# EAGLE design Board (EAGLE 8.4.0)
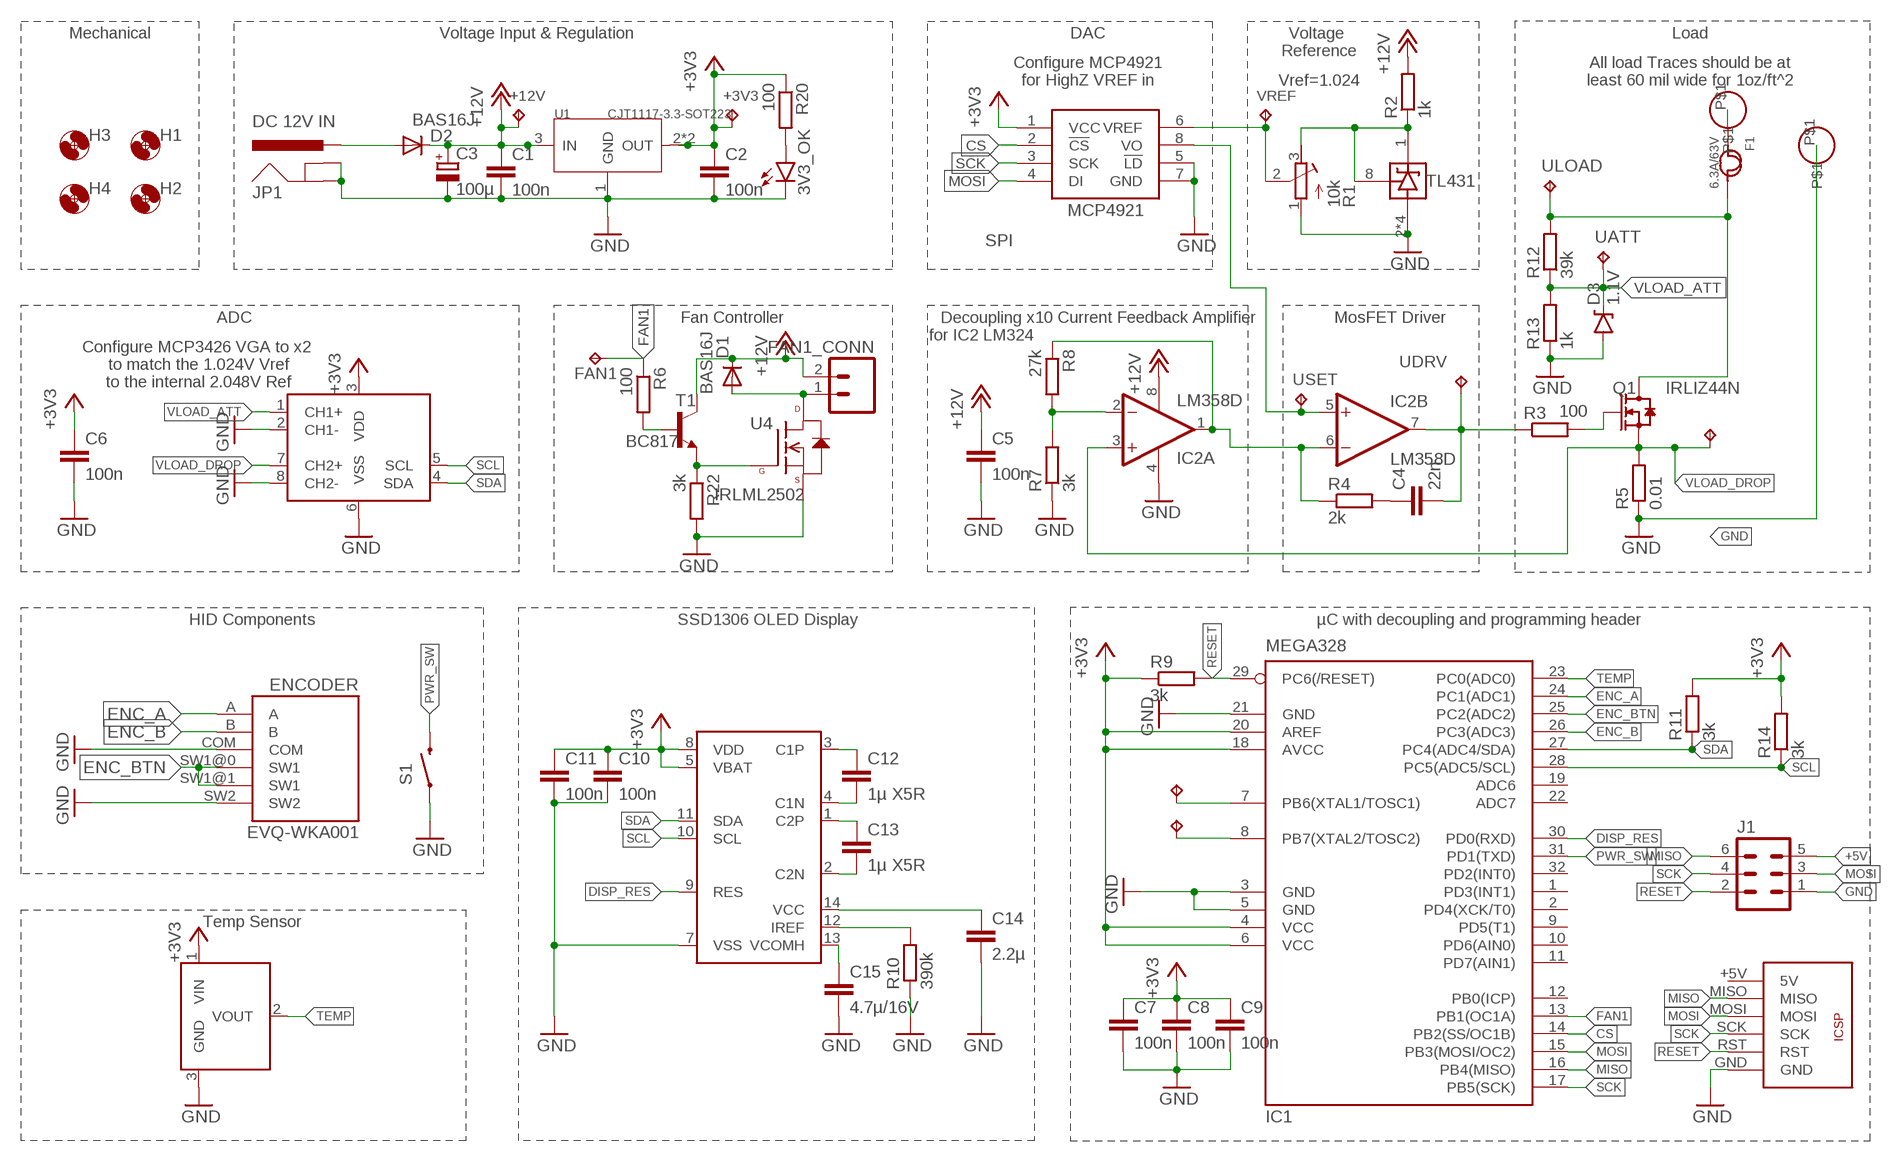
[diagram p0: schematic, sheet 1]

## Parts
3V3_OK  LED0603  [LED-0603]
+3V3  TPB1,27  [B1,27]
+12V  TPB1,27  [B1,27]
C1  100n  C-EUC0603  [C0603]
C2  100n  C-EUC0603  [C0603]
C3  100µ  CPOL-EU153CLV-0405  [153CLV-0405]
C4  22n  C-EUC0603  [C0603]
C5  100n  C-EUC0603  [C0603]
C6  100n  C-EUC0603  [C0603]
C7  100n  C-EUC0603  [C0603]
C8  100n  C-EUC0603  [C0603]
C9  100n  C-EUC0603  [C0603]
C10  100n  C-EUC0603  [C0603]
C11  100n  C-EUC0603  [C0603]
C12  1µ X5R  C-EUC0603  [C0603]
C13  1µ X5R  C-EUC0603  [C0603]
C14  2.2µ  C-EUC0603  [C0603]
C15  4.7µ/16V  C-EUC0603  [C0603]
D1  BAS16J  DIODE-SOD323-W  [SOD323-W]
D2  BAS16J  DIODE-SOD323-W  [SOD323-W]
D3  1.1V  DIODE-ZENER5.6V  [SOD-323]
ENCODER  EVQ-WKA001  [EVQ-WKA001]
F1  6.3A/63V  FUSE'1206'  [F1206]
FAN1  TPB1,27  [B1,27]
FAN1_CONN  M02POLAR  [MOLEX-1X2]
H1  MOUNT-HOLE3.0  [3,0]
H2  MOUNT-HOLE3.0  [3,0]
H3  MOUNT-HOLE3.0  [3,0]
H4  MOUNT-HOLE3.0  [3,0]
IC1  MEGA328  MEGA8-AI  [TQFP32-08]
IC2  LM358D  [SO08]
IC4  MCP3426  [SO08]
IC6  MCP4921  [SO-8]
IC7  TL431CD  [SO-8]
IN+  6MM-BANANA-MOUNTINGHOLE  [6MM-BANANA-MOUNT]
IN-  6MM-BANANA-MOUNTINGHOLE  [6MM-BANANA-MOUNT]
J1  MA03-2  [MA03-2]
JP1  DC 12V IN  POWER_JACKPTH  [POWER_JACK_PTH]
Q1  IRLIZ44N  IRF3710  [TO-220H]
R1  10k  R-TRIMM3296W  [RTRIM3296W]
R2  1k  R-EU_R0603  [R0603]
R3  100  R-EU_R0603  [R0603]
R4  2k  R-EU_R0603  [R0603]
R5  0.01  R-EU_R2512  [R2512]
R6  100  R-EU_R0603  [R0603]
R7  3k  R-EU_R0603  [R0603]
R8  27k  R-EU_R0603  [R0603]
R9  3k  R-EU_R0603  [R0603]
R10  390k  R-EU_R0603  [R0603]
R11  3k  R-EU_R0603  [R0603]
R12  39k  R-EU_R0603  [R0603]
R13  1k  R-EU_R0603  [R0603]
R14  3k  R-EU_R0603  [R0603]
R20  100  R-EU_R0603  [R0603]
R22  3k  R-EU_R0603  [R0603]
S1  SWITCH-MOMENTARY-2SMD-1101NE  [TACTILE-SWITCH-1101NE]
T1  BC817  BC817-NPN-SOT23-BEC  [SOT23-BEC]
U1  CJT1117-3.3-SOT223  PMIC-CJT1117-3.3(SOT223)  [SOT-223]
U3  MCP9701AT-E/TT  [SOT32-3]
U4  IRLML2502  N-CHANNEL-MOSFET-BSS138  [SOT23-3]
U$2  0.86"-OLEDBENT  [0.86"-OLED-BENT]
U$4  ICSP  [ICSP-SMD-NOSILK]
UATT  TPB1,27  [B1,27]
UDROP  TPB1,27  [B1,27]
UDRV  TPB1,27  [B1,27]
ULOAD  TPB1,27  [B1,27]
USET  TPB1,27  [B1,27]
VREF  TPB1,27  [B1,27]
XTAL1  TPB1,27  [B1,27]
XTAL2  TPB1,27  [B1,27]

## Nets
+3V3: +3V3.TP C2.1 C6.1 C7.1 C8.1 C9.1 C10.1 C11.1 IC1.4(VCC) IC1.6(VCC) IC1.18(AVCC) IC1.20(AREF) IC4.3(VDD) IC6.1(VCC) R9.1 R11.2 R14.2 R20.1 U1.2(OUT) U1.TER(OUT) U3.1(VIN) U$2.5(VBAT) U$2.8(VDD)
+5V: J1.5
+12V: +12V.TP C1.1 C3.+ C5.1 D1.C D2.C FAN1_CONN.2 IC2.8(P:V+) R2.2 T1.C U1.3(IN)
CS: IC1.14(PB2(SS/OC1B)) IC6.2(!CS!)
DISP_RES: IC1.30(PD0(RXD)) U$2.9(RES)
ENC_A: ENCODER.A IC1.24(PC1(ADC1))
ENC_B: ENCODER.B IC1.26(PC3(ADC3))
ENC_BTN: ENCODER.SW1@0(SW1) ENCODER.SW1@1(SW1) IC1.25(PC2(ADC2))
FAN1: FAN1.TP IC1.13(PB1(OC1A)) R6.1
GND: 3V3_OK.C C1.2 C2.2 C3.- C5.2 C6.2 C7.2 C8.2 C9.2 C10.2 C11.2 C14.2 C15.2 D3.A ENCODER.COM ENCODER.SW2 IC1.3(GND) IC1.5(GND) IC1.21(GND) IC2.4(P:V-) IC4.2(CH1-) IC4.6(VSS) IC4.8(CH2-) IC6.5(!LD!) IC6.7(GND) IC7.2(ANODE) IC7.3(ANODE) IC7.6(ANODE) IC7.7(ANODE) IN-.P$1 J1.1 JP1.GND JP1.GNDBREAK R1.1(A) R5.1 R7.1 R10.1 R13.1 R22.2 S1.1 U1.1(GND) U3.3(GND) U4.2(S) U$2.7(VSS) U$4.GND
LOAD+: F1.2 Q1.P$2(D) R12.2 ULOAD.TP
MISO: IC1.16(PB4(MISO)) J1.6 U$4.MISO
MOSI: IC1.15(PB3(MOSI/OC2)) IC6.4(DI) J1.3 U$4.MOSI
N$1: IC7.1(CATHODE) IC7.8(REF) R1.3(E) R2.1
N$2: IC6.6(VREF) R1.2(S) VREF.TP
N$3: C4.1 R4.2
N$4: R22.1 T1.E U4.1(G)
N$5: D1.A FAN1_CONN.1 U4.3(D)
N$6: Q1.P$1(G) R3.2
N$7: F1.1 IN+.P$1
N$8: R6.2 T1.B
N$9: IC2.1(A:OUT) IC2.6(B:-IN) R4.1 R8.1
N$10: C4.2 IC2.7(B:OUT) R3.1 UDRV.TP
N$11: IC2.2(A:-IN) R7.2 R8.2
N$12: IC1.8(PB7(XTAL2/TOSC2)) XTAL2.TP
N$13: IC1.7(PB6(XTAL1/TOSC1)) XTAL1.TP
N$16: C12.1 U$2.3(C1P)
N$17: C12.2 U$2.4(C1N)
N$18: C13.1 U$2.1(C2P)
N$19: C13.2 U$2.2(C2N)
N$20: C15.1 U$2.13(VCOMH)
N$21: R10.2 U$2.12(IREF)
N$22: C14.1 U$2.14(VCC)
N$51: 3V3_OK.A R20.2
PWR_SW: IC1.31(PD1(TXD)) S1.2
RESET: IC1.29(PC6(/RESET)) J1.2 R9.2 U$4.RST
SCK: IC1.17(PB5(SCK)) IC6.3(SCK) J1.4 U$4.SCK
SCL: IC1.28(PC5(ADC5/SCL)) IC4.5(SCL) R14.1 U$2.10(SCL)
SDA: IC1.27(PC4(ADC4/SDA)) IC4.4(SDA) R11.1 U$2.11(SDA)
TEMP: IC1.23(PC0(ADC0)) U3.2(VOUT)
VLOAD_ATT: D3.C IC4.1(CH1+) R12.1 R13.2 UATT.TP
VLOAD_DROP: IC2.3(A:+IN) IC4.7(CH2+) Q1.P$3(S) R5.2 UDROP.TP
VLOAD_REF: IC2.5(B:+IN) IC6.8(VO) USET.TP
VSW: D2.A JP1.PWR
Unconnected: IC1.1(PD3(INT1)) IC1.2(PD4(XCK/T0)) IC1.9(PD5(T1)) IC1.10(PD6(AIN0)) IC1.11(PD7(AIN1)) IC1.12(PB0(ICP)) IC1.19(ADC6) IC1.22(ADC7) IC1.32(PD2(INT0)) U$4.+5V(5V)

## Notes on the sheet
- Mechanical | Voltage Input & Regulation | DAC | Load
- Configure MCP4921
  for HighZ VREF in
- Voltage 
  Reference
- All load Traces should be at 
  least 60 mil wide for 1oz/ft^2
- Vref=1.024
- SPI
- ADC | Fan Controller | x10 Current Feedback Amplifier | MosFET Driver
- Configure MCP3426 VGA to x2 
  to match the 1.024V Vref
  to the internal 2.048V Ref
- Decoupling
  for IC2 LM324
- HID Components | SSD1306 OLED Display | µC with decoupling and programming header
- Temp Sensor

## Library data of the parts
3V3_OK = SparkFun-LED:LED: LEDs Standard schematic elements and footprints for 5mm, 3mm, 1206, and 0603 sized LEDs. 5mm - Spark Fun Electronics SKU : COM-00529 (and others)
+3V3 +12V FAN1 UATT UDROP UDRV ULOAD USET VREF XTAL1 XTAL2 = testpad:TP: Test pad
C1 C2 C4-C15 = rcl:C-EU: CAPACITOR, European symbol
C3 = rcl:CPOL-EU: POLARIZED CAPACITOR, European symbol
D1 D2 = diode:DIODE-: DIODE
D3 = SparkFun-DiscreteSemi:DIODE-ZENER: Zener Diode Production Part - 8199 3.4V Zener Voltage; PROD_ID: DIO-12442; VALUE: 5.6V
ENCODER = EVQ-WKA001:EVQ-WKA001
F1 = Seeed-OPL-fuse:FUSE
FAN1_CONN = SparkFun-Connectors:M02: Standard 2-pin 0.1" header. Use with - straight break away headers ( PRT-00116) - right angle break away headers (PRT-00553) - swiss pins (PRT-00743) - machine pins (PRT-00117) - female headers (PRT-00115) Molex polarized connector foot print use with: PRT-08233 with associated crimp pins and housings. 2.54_SCREWTERM for use with PRT-10571. 3.5mm Screw Terminal footprints for PRT-08084 5mm Screw Terminal footprints for use with PRT-08432
H1-H4 = holes:MOUNT-HOLE: MOUNTING HOLE with drill center marker
IC1 = atmel:MEGA8: MICROCONTROLLER 8 Kbytes FLASH, 1 kbytes SRAM, 512 bytes EEPROM, USART, 6-channel 10 bit ADC, 2-channel 8 bit ADC Pin compatible with Atmega48, ATMega88, ATMega168 Source: avr.lbr; MPN: ATMEGA8-16AU; OC_FARNELL: 9171371; OC_NEWARK: 73M8863
IC2 = linear:LM358: OP AMP also LM158; LM258; LM2904 Source: http://cache.national.com/ds/LM/LM158.pdf
IC4 = components:MCP3426
IC6 = OwnStuff:MCP4921
IC7 = OwnStuff:TL431
IN+ IN- = components:6MM-BANANA-MOUNTINGHOLE
J1 = con-lstb:MA03-2: PIN HEADER; OC_FARNELL: unknown; OC_NEWARK: unknown
JP1 = SparkFun-Connectors:POWER_JACK: Power Jack This is the standard 5.5mm barrel jack for power. The PTH is the most common, proven, reliable, footprint. The Slot footprint only works if the mill layer is transmitted to the PCB fab house so be warned. Mating wall wart : TOL-00298 (and others); PROD_ID: CONN-08197
Q1 = components:IRF3710
R1 = rcl:R-TRIMM: Trimm resistor
R2-R14 R20 R22 = rcl:R-EU_: RESISTOR, European symbol
S1 = SparkFun-Electromechanical:SWITCH-MOMENTARY-2: Various NO switches- pushbuttons, reed, etc; PROD_ID: SWCH-00815
T1 = transistor:*-NPN-: NPN Transistror BF959 corrected 2008.03.06
U1 = Seeed-OPL-ic:PMIC-CJT1117-3.3(SOT223): 310030097; MPN: CJT1117-3.3
U3 = components:MCP9701AT-E/TT
U4 = GeekAmmo:N-CHANNEL-MOSFET: N-Channel MOSFET Mode Field Effect Transistor; DATASHEET: http://www.fairchildsemi.com/ds/BS/BSS138.pdf; DIGIKEY: BSS138TR-ND; ELEMENT14: 2323154; URL: http://au.element14.com/fairchild-semiconductor/bss138/mosfet-n-ch-50v-220ma-sot-23/dp/2323154
U$2 = components:0.86"-OLED
U$4 = OwnStuff:ICSP

## Board
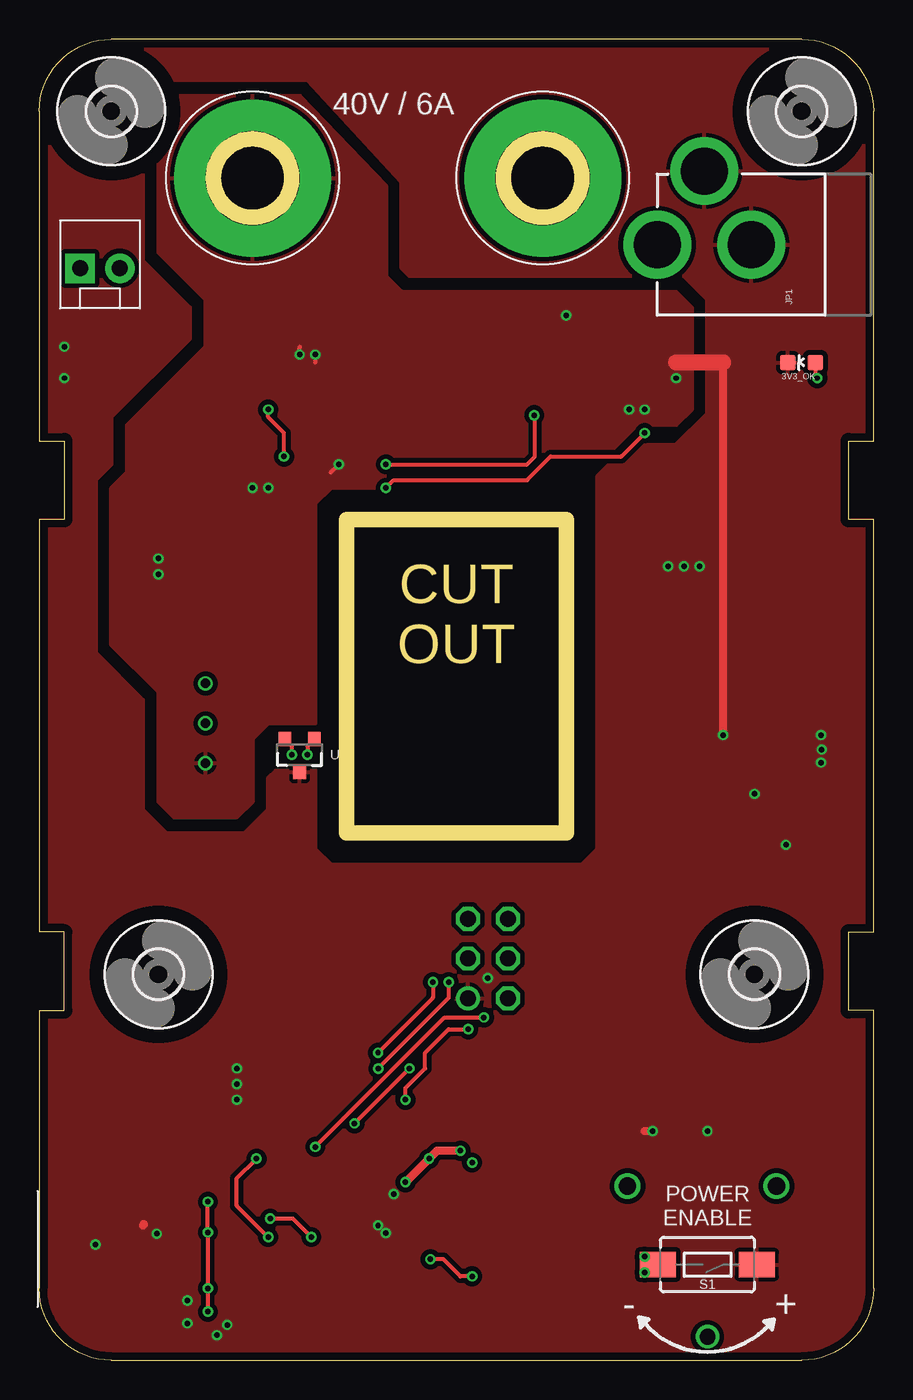
[diagram p1: board, top side]
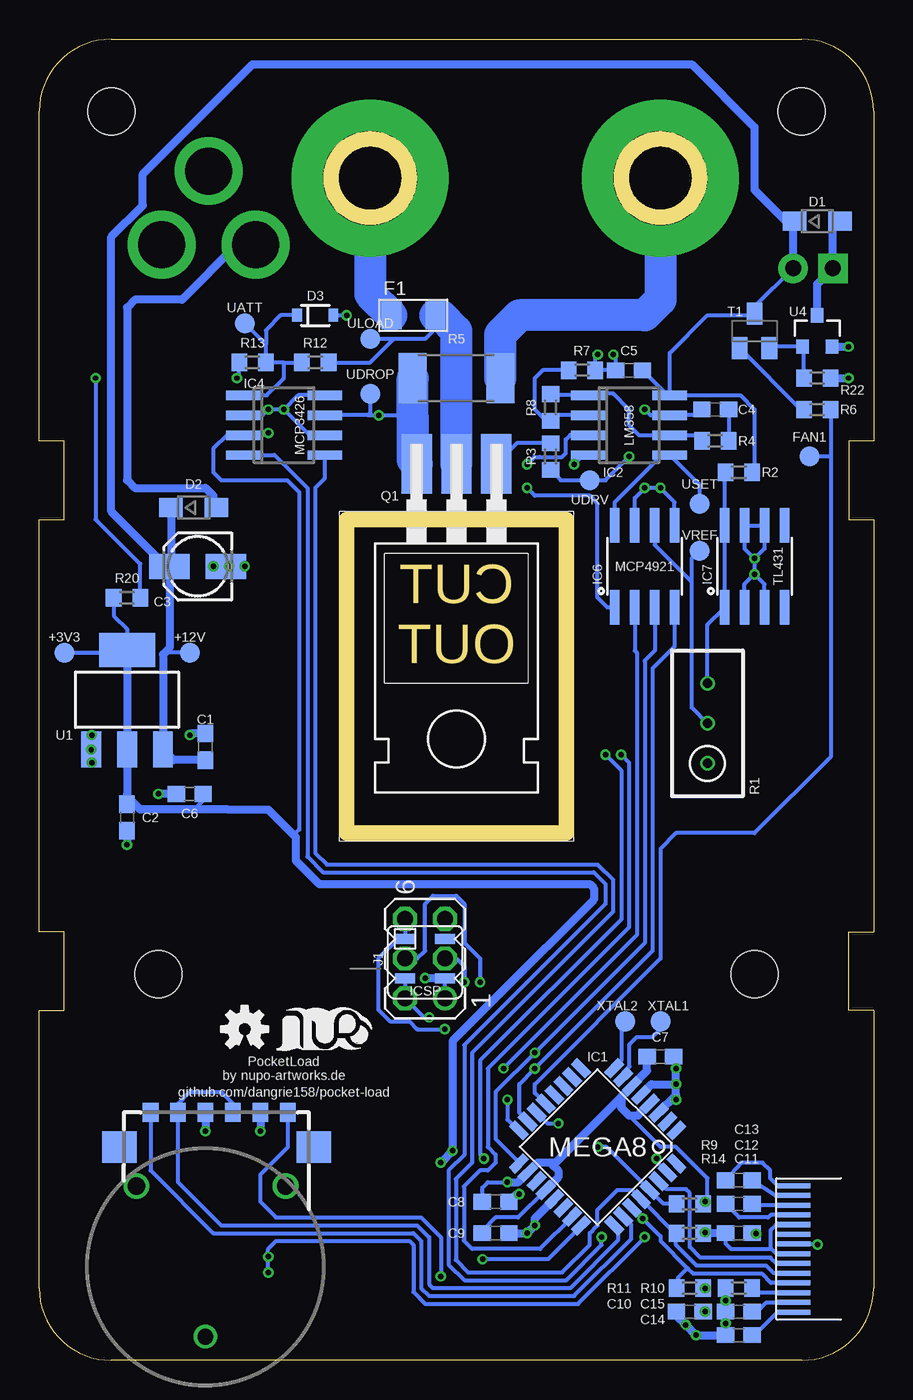
[diagram p2: board, bottom side, seen from below]

Size 53.2 x 84.2 mm. Coordinates in mm from the lower left corner, seen from the top.
Outline: 4.6,0 48.6,0 arc90 53.2,4.6 53.2,22.3 51.6,22.3 51.6,27.3 53.2,27.3 53.2,53.6 51.6,53.6 51.6,58.6 53.2,58.6 53.2,79.6 arc90 48.6,84.2 4.6,84.2 arc90 0,79.6 0,58.6 1.6,58.6 1.6,53.6 0,53.6 0,27.3 1.6,27.3 1.6,22.3 0,22.3 0,4.6 arc90 4.6,0
Copper layers (1*16): Top 0.035mm / dielectric 1.6mm / Bottom 0.035mm
Design rules "Elecrow_2-layer_PCB_eagle_rule *": minimum track width 6mil, minimum drill 12mil, track to track 6mil, track to pad 8mil, pad to pad 6mil, via to via 12mil, smd to smd 0mil, copper to edge 20mil, drill to drill 10mil, minimum pad ring 6mil, minimum via ring 6mil, stop-mask expansion 0mil, vias tented up to drill 100mil, thermal gap 10mil
Milling: 12 lines

### Footprints (pad centres in the part's own frame; a part is rotated, then mirrored left to right if it is on the bottom)
LED-0603 = smd 1 x 1: A 0,-0.877; C 0,0.877
B1,27 = smd 1.27 x 1.27: TP 0,0
C0603 = smd 1.1 x 1: 1 -0.85,0; 2 0.85,0
153CLV-0405 = smd 2.6 x 1.6: + 1.8,0; - -1.8,0
SOD323-W = smd 1.5 x 1.2: A 1.45,0; C -1.45,0
SOD-323 = smd 0.63 x 0.83: A 1.15,0; C -1.15,0
EVQ-WKA001 = smd 1 x 1.2: A -5.25,-4.7; B 3.5,-4.7; COM -3.5,-4.7; SW1@0 1.75,-4.7; SW1@1 -1.75,-4.7; SW2 0,-4.7 | smd 2.2 x 2: NC@0 5.5,-2.5; NC@1 -6.9,-2.5 | drill 1.1: P$9 4.4,0; P$10 -5.1,0 | drill 1: P$11 0,9.6
F1206 = smd 1.27 x 1.778: 1 -1.397,0; 2 1.397,0
MOLEX-1X2 = drill 1.016 pad 1.88 square: 1 0,0 | drill 1.016 pad 1.88: 2 2.54,0
3,0 = hole 3: 0,0
TQFP32-08 = smd 1.27 x 0.559: 1 -4.293,2.8; 2 -4.293,2; 3 -4.293,1.2; 4 -4.293,0.4; 5 -4.293,-0.4; 6 -4.293,-1.2; 7 -4.293,-2; 8 -4.293,-2.8; 17 4.293,-2.8; 18 4.293,-2; 19 4.293,-1.2; 20 4.293,-0.4; 21 4.293,0.4; 22 4.293,1.2; 23 4.293,2; 24 4.293,2.8 | smd 0.559 x 1.27: 9 -2.8,-4.293; 10 -2,-4.293; 11 -1.2,-4.293; 12 -0.4,-4.293; 13 0.4,-4.293; 14 1.2,-4.293; 15 2,-4.293; 16 2.8,-4.293; 25 2.8,4.293; 26 2,4.293; 27 1.2,4.293; 28 0.4,4.293; 29 -0.4,4.293; 30 -1.2,4.293; 31 -2,4.293; 32 -2.8,4.293
SO08 = smd 0.6 x 2.2: 1 -1.905,-2.6; 2 -0.635,-2.6; 3 0.635,-2.6; 4 1.905,-2.6; 5 1.905,2.6; 6 0.635,2.6; 7 -0.635,2.6; 8 -1.905,2.6
SO-8 = smd 0.61 x 2.21: 1 -1.905,-2.616; 2 -0.635,-2.616; 3 0.635,-2.616; 4 1.905,-2.616; 5 1.905,2.616; 6 0.635,2.616; 7 -0.635,2.616; 8 -1.905,2.616
6MM-BANANA-MOUNT = drill 6 pad 10: P$1 0,0
MA03-2 = drill 1.016: 1 -2.54,-1.27 | drill 1.016 octagon: 2 -2.54,1.27; 3 0,-1.27; 4 0,1.27; 5 2.54,-1.27; 6 2.54,1.27
POWER_JACK_PTH = drill 2.997 pad 4.318: GND 0,7.7; GNDBREAK 4.7,10.7; PWR 0,13.7
TO-220H = smd 1.93 x 3.81: P$1 -2.54,-2.54; P$2 0,-2.54; P$3 2.54,-2.54
RTRIM3296W = drill 0.61: 1 0,-2.54; 2 0,0; 3 0,2.54
R0603 = smd 1 x 1.1: 1 -0.85,0; 2 0.85,0
R2512 = smd 1.8 x 3.2: 1 -2.8,0; 2 2.8,0
TACTILE-SWITCH-1101NE = smd 2.3 x 1.6: 1 -3.15,0; 2 3.15,0
SOT23-BEC = smd 1 x 1.4: B -0.95,-1.1; C 0,1.1; E 0.95,-1.1
SOT-223 = smd 1.27 x 2.286: 1 -2.286,-3.175; 2 0,-3.175; 3 2.286,-3.175 | smd 3.556 x 2.159: TER 0,3.175
SOT32-3 = smd 0.8 x 0.9: 1 -0.95,-1; 2 0.95,-1; 3 0,1.1
SOT23-3 = smd 0.8 x 0.9: 1 -0.95,-1; 2 0.95,-1; 3 0,1
0.86"-OLED-BENT = smd 2.1 x 0.32 bottom: 1 0,4.03; 2 0,3.41; 3 0,2.79; 4 0,2.17; 5 0,1.55; 6 0,0.93; 7 0,0.31; 8 0,-0.31; 9 0,-0.93; 10 0,-1.55; 11 0,-2.17; 12 0,-2.79; 13 0,-3.41; 14 0,-4.03
ICSP-SMD-NOSILK = smd 1.27 x 0.635: +5V 1.27,1.27; GND 1.27,-1.27; MISO -1.27,1.27; MOSI 1.27,0; RST -1.27,-1.27; SCK -1.27,0

### Placement (x,y rotation side)
3V3_OK  48.6,63.6 90 top
+3V3  51.6,45.1 0 bottom
+12V  43.6,45.1 0 bottom
C1  42.6,39.1 90 bottom
C2  47.6,34.6 270 bottom
C3  43.1,50.6 180 bottom
C4  10.1,60.6 180 bottom
C5  15.6,63.1 180 bottom
C6  43.6,36.1 180 bottom
C7  13.6,19.35 0 bottom
C8  24.1,10.1 0 bottom
C9  24.1,8.1 0 bottom
C10  11.72,3.1 180 bottom
C11  8.6,8.1 0 bottom
C12  8.6,9.97 180 bottom
C13  8.6,11.47 0 bottom
C14  8.6,1.6 180 bottom
C15  8.6,3.1 180 bottom
D1  3.6,72.6 0 bottom
D2  43.35,54.35 0 bottom
D3  35.6,66.6 0 bottom
ENCODER  42.6,11.1 180 bottom
F1  29.35,66.6 0 bottom
FAN1  4.1,57.6 0 bottom
FAN1_CONN  2.6,69.6 0 top
H1  4.6,79.6 0 top
H2  48.6,79.6 0 top
H3  45.6,24.6 0 top
H4  7.6,24.6 0 top
IC1  17.6,13.6 225 bottom
IC2  15.6,59.6 270 bottom
IC4  37.6,59.6 270 bottom
IC6  14.6,50.6 0 bottom
IC7  7.6,50.6 0 bottom
IN+  32.1,75.35 0 top
IN-  13.6,75.35 0 top
J1  28.6,25.6 90 bottom
JP1  53.1,71.1 90 top
Q1  26.6,54.6 180 bottom
R1  10.6,40.6 0 bottom
R2  8.6,56.6 0 bottom
R3  20.6,57.6 90 bottom
R4  10.1,58.6 0 bottom
R5  26.6,62.6 180 bottom
R6  3.6,60.6 180 bottom
R7  18.6,63.1 180 bottom
R8  20.6,60.73 270 bottom
R9  11.72,9.97 180 bottom
R10  8.6,4.6 0 bottom
R11  11.72,4.6 0 bottom
R12  35.6,63.6 0 bottom
R13  39.6,63.6 0 bottom
R14  11.72,8.1 0 bottom
R20  47.6,48.6 0 bottom
R22  3.6,62.6 0 bottom
S1  42.6,6.1 180 top
T1  7.6,65.6 0 bottom
U1  47.6,42.1 0 bottom
U3  16.6,38.6 180 top
U4  3.6,65.6 0 bottom
U$1  [LOGO-SILKSCREEEN-S]  35.1,20.6 0 bottom
U$2  5.1,7.1 0 top
U$3  [OSHW-LOGO-S]  40.1,21.1 0 bottom
U$4  28.6,25.6 0 bottom
UATT  40.1,66.1 0 bottom
UDROP  32.1,61.6 0 bottom
UDRV  18.1,56.1 0 bottom
ULOAD  32.1,65.1 0 bottom
USET  11.1,54.6 0 bottom
VREF  11.1,51.6 0 bottom
XTAL1  13.6,21.6 0 bottom
XTAL2  15.85,21.6 0 bottom

### Tracks (layer width: path | path; a pad name or v marks a point on that pad's centre or on a via)
+3V3  (via drill 0.35)
  Top 0.254: v22.1,55.6 22.6,56.1 31.1,56.1 32.6,57.6 37.1,57.6 v38.6,59.1 | v10.75,10.1 v10.75,8.15 v10.75,4.59 v10.75,3.1 | 17.6,39.6 17.55,39.65 U3.1 17.1,39.15 v17.1,38.6
  Top 0.508: v26.85,13.35 25.35,13.35 v24.85,12.85 v23.35,11.35
  Bottom 0.254: 9.2,8.1 C11.1 9.45,7.45 9.1,7.1 6.59,7.1 6.56,7.13 6.55,7.13 | U$2.5 6.21,8.65 6.55,8.31 6.55,7.13 | U$2.8 6.21,6.79 6.55,7.13 | 47.6,36.25 47.6,36.09 C2.1 | R20.1 48.45,47.45 47.6,46.6 U1.TER 47.77,45.1 +3V3.TP | IC6.1 16.98,47.98 17.6,48.6 17.6,54.6 18.1,55.1 21.6,55.1 v22.1,55.6 | v38.6,59.1 38.73,58.97 IC4.3 41.23,58.97 42.1,58.1 42.1,56.6 41.6,56.1 37.39,56.1 36.62,55.33 36.62,33.82 36.97,33.47 | IC1.20 22.67,9.1 24.1,9.1 24.95,8.25 C9.1 | 15.6,15.6 13.6,13.6 12.6,13.6 10.6,11.6 10.6,10.25 v10.75,10.1 R9.1 | R11.2 v10.75,4.59 | R14.2 v10.75,8.15 | 23.6,23.6 23.85,23.35 | C8.1 24.95,11 24.6,11.35 v23.35,11.35 | C6.1 42.75,35.68 43.33,35.1 | 41.1,35.15 41.15,35.1 | C10.1 v10.75,3.1 | v17.1,38.6 16.1,37.6 16.1,28.1 25.1,19.1 25.1,13.1 v24.85,12.85
  Bottom 0.508: C11.1 R14.2 | U1.TER U1.2 47.6,36.09 47.6,35.95 46.75,35.1 43.33,35.1 41.15,35.1 38.6,35.1 36.97,33.47 36.85,33.35 36.85,31.85 35.35,30.35 18.1,30.35 17.85,30.1 17.85,29.35 23.85,23.35 26.85,20.35 v26.85,13.35 v27.6,12.6 | 23.45,11.35 v23.35,11.35 22.68,11.35 IC1.18 21.43,12.6 20.6,12.6 | IC1.4 15.03,15.6 15.6,15.6 16.1,16.1 16.1,16.8 | 16.1,16.8 IC1.6 14.45,18.45 C7.1 | IC1.20 20.1,11.67 20.1,12.1 20.6,12.6 | 16.1,16.8 20.3,12.6 20.6,12.6
+12V
  Bottom 0.254: 7.6,67.14 FAN1_CONN.2 | IC2.8 13.15,61.51 C5.1 | IC2.8 13,64.2 10.6,66.6 7.7,66.6 T1.C | IC2.8 8.51,61.51 7.6,60.6 7.6,56.75 R2.2 | +12V.TP 45.21,45.1 45.31,45
  Bottom 0.508: T1.C 7.6,67.14 | FAN1_CONN.2 5.14,72.51 D1.C 5.6,72.6 7.6,74.6 7.6,78.6 11.6,82.6 39.6,82.6 46.6,75.6 46.6,73.6 48.6,71.6 48.6,54.1 45.1,50.6 C3.+ | C1.1 44.64,38.25 U1.3 45.31,45 44.9,45.41 C3.+ | D2.C 44.8,50.7 C3.+
CS  (via drill 0.35)
  Top 0.254: v20.1,15.1 v23.6,18.6
  Bottom 0.254: IC6.2 15.23,45.23 15.1,45.1 15.1,27.1 v23.6,18.6 | IC1.14 20.8,15.1 v20.1,15.1
DISP_RES
  Bottom 0.254: U$2.9 6.21,6.17 6.58,6.54 11.04,6.54 11.72,7.22 11.72,10.66 11.97,10.9 13.21,10.9 IC1.30
ENC_A  (via drill 0.35)
  Top 0.254: v27.6,5.35 26.85,5.35 25.76,6.44 v24.94,6.44
  Bottom 0.254: ENCODER.A 37.35,13.6 39.1,11.85 39.1,10.1 38.1,9.1 28.85,9.1 27.6,7.85 v27.6,5.35 | v24.94,6.44 20.76,6.44 18.66,8.54 IC1.24
ENC_B
  Bottom 0.254: ENCODER.B 46.1,12.1 42.1,8.1 29.35,8.1 28.85,7.6 28.85,4.6 28.35,4.1 19.1,4.1 15.47,7.72 15.47,8.65 IC1.26
ENC_BTN
  Bottom 0.254: ENCODER.SW1@1 40.85,16.35 41.6,17.1 43.6,17.1 44.35,16.35 ENCODER.SW1@0 44.35,11.35 41.6,8.6 29.1,8.6 28.35,7.85 28.35,4.85 28.1,4.6 19.35,4.6 16.3,7.65 16.3,8.34 IC1.25
FAN1
  Bottom 0.254: R6.1 2.75,57.6 | 2.75,57.6 2.75,38.45 7.6,33.6 12.6,33.6 13.6,32.6 13.6,25.6 21.6,17.6 21.6,17.03 IC1.13 | 2.75,57.6 FAN1.TP
GND  (via drill 0.35)
  Top 0.254: v19.1,57.1 18.6,56.6 | v16.6,64.1 16.6,64.6 | v17.6,64.1 17.6,63.6 | v3.58,7.37 3.6,7.6
  Top 0.508: v43.6,39.85 43.6,63.6 | v39.1,14.6 38.6,14.6 | 6.69,8.69 6.6,8.6
  Top 1.016: 43.6,63.6 40.6,63.6
  Bottom 0.254: R13.1 40.45,62.75 v40.6,62.6 | IC4.2 38.97,60.23 v38.6,60.6 v37.6,60.6 | IC4.8 36.7,61.51 v37.6,60.6 | IC4.6 35.97,58.97 v37.6,60.6 | IC2.4 18.51,57.7 v19.1,57.1 | v16.6,64.1 16.45,63.95 C5.2 R7.1 17.75,63.95 v17.6,64.1 | IC7.3 6.96,49.47 v7.6,50.1 | IC7.2 8.23,49.47 v7.6,50.1 | v7.6,51.1 v7.6,50.1 | v7.6,51.1 8.23,51.73 IC7.7 IC7.6 6.96,51.73 v7.6,51.1 | IC6.5 12.7,54.7 v13.6,55.6 v14.6,55.6 15.23,54.97 IC6.7 | U$2.7 3.87,7.41 v3.58,7.37 | D3.A v33.6,66.6 | J1.1 U$4.GND
  Bottom 0.508: R22.2 v1.6,62.6 | U4.2 v1.6,64.6 | U1.1 49.89,38.14 v49.85,38.1 | C2.2 v47.6,32.85 | C6.2 v45.6,36.1 | C1.2 43.5,39.95 v43.6,39.85 | ENCODER.SW2 v42.6,14.6 | ENCODER.COM v39.1,14.6 | v12.6,17.6 v12.61,17.61 12.61,16.9 | 12.61,16.9 IC1.3 | v12.6,16.6 v12.61,16.61 12.61,16.9 | IC1.21 21.6,9.03 v21.6,8.6 v22.1,8.1 C9.2 | C8.2 22.75,10.6 v22.6,10.6 | R10.1 v9.45,3.81 C15.2 v9.45,2.36 C14.2 v11.32,1.6 v11.98,2.26 12.57,2.85 C10.2 | C11.2 7.46,8.1 v7.49,8.06 | v12.6,17.6 v12.6,18.6 12.6,19.2 C7.2 | IC1.5 14.17,17.6 v12.6,17.6 | C3.- v41.1,50.6 | U$4.GND 27.35,24.35 v28.6,24.35
  Bottom 2.032: R5.1 23.8,65.4 22.6,66.6 14.6,66.6 13.6,67.6 IN-.P$1
  other vias: 49.89,38.93 49.85,39.85 40.1,50.6 42.1,50.6
  pour Top (isolate 0.305, rank 2): 14.6,40.6 13.6,39.6 13.6,35.6 12.6,34.6 8.6,34.6 7.6,35.6 7.6,42.6 4.6,45.6 4.6,55.6 5.6,56.6 5.6,59.6 10.6,64.6 10.6,67.6 7.6,70.6 7.6,80.6 16.6,80.6 22.1,74.85 22.1,69.1 23.1,68.1 40.6,68.1 41.6,67.1 41.6,60.6 40.6,59.6 38.1,59.6 36.1,57.6 32.6,57.6 30.6,55.6 18.6,55.6 17.6,54.6 17.6,40.6
  pour Top (isolate 0.305): 48.6,0.6 4.6,0.6 arc-90 0.6,4.6 0.6,80.6 6.6,80.6 6.6,70.1 9.6,67.1 9.6,65.1 4.6,60.1 4.6,57.1 3.6,56.1 3.6,45.1 6.6,42.1 6.6,35.1 8.1,33.6 13.1,33.6 14.6,35.1 14.6,37.1 15.1,37.6 17.6,37.6 17.6,32.6 18.6,31.6 34.6,31.6 35.6,32.6 35.6,56.35 37.6,58.35 40.6,58.35 42.6,60.35 42.6,67.6 41.1,69.1 23.6,69.1 23.1,69.6 23.1,75.1 17.1,81.6 4.6,81.6 4.6,83.6 48.6,83.6 arc-90 52.6,79.6 52.6,4.6 arc-90
LOAD+
  Bottom 0.254: R12.2 32.1,63.6 30.6,65.1 | 30.6,65.1 28.6,65.1 28.1,65.6 28.1,66.45 F1.2 | 30.6,65.1 ULOAD.TP
  Bottom 2.032: Q1.P$2 26.6,65.6 27.6,66.6 F1.2
MISO  (via drill 0.35)
  Top 0.254: v23.35,16.6 23.35,17.35 24.6,18.6 24.6,19.6 26.1,21.1 v27.35,21.1
  Bottom 0.254: IC1.16 22.66,14.65 23.35,15.35 v23.35,16.6 | J1.6 U$4.MISO 30.33,26.87 31.6,25.6 31.6,22.35 30.85,21.6 29.6,21.6 29.1,21.1 v27.35,21.1
MOSI  (via drill 0.35)
  Top 0.254: v26.1,24.1 26.1,23.1 v21.6,18.6 v21.61,18.59
  Bottom 0.254: IC6.4 12.7,45.51 14.1,44.1 14.1,26.1 v21.61,18.59 22.6,17.6 22.6,15.77 IC1.15 | J1.3 26.6,25.6 26.1,25.1 v26.1,24.1
N$1
  Bottom 0.254: R1.3 10.6,46.89 IC7.1 IC7.8 9.5,56.55 R2.1
N$2
  Bottom 0.254: IC6.6 13.96,51.97 11.6,49.6 | 11.6,49.6 11.6,41.6 R1.2 | 11.6,49.6 11.6,51.1 VREF.TP
N$3
  Bottom 0.254: C4.1 R4.2
N$4
  Bottom 0.254: T1.E 6.55,64.6 U4.1 4.45,64.5 R22.1
N$5
  Bottom 0.508: D1.A 2.6,72.15 FAN1_CONN.1 3.6,68.6 U4.3
N$6
  Bottom 0.254: R3.2 22.75,58.45 Q1.P$1
N$7
  Bottom 2.032: IN+.P$1 32.1,67.95 F1.1
N$8
  Bottom 0.254: R6.2 4.65,60.6 T1.B
N$9
  Bottom 0.254: 18.33,61.51 IC2.1 | 18.33,61.51 20.55,61.51 R8.1 | 18.33,61.51 18.24,61.6 16.6,61.6 15.6,60.6 15.6,59.6 14.96,58.97 IC2.6 11.31,58.97 R4.1
N$10  (via drill 0.35)
  Top 0.254: v15.6,57.6 15.6,59.1 14.6,60.1 v14.6,60.6
  Bottom 0.254: C4.2 11.31,60.23 IC2.7 14.23,60.23 v14.6,60.6 | R3.1 19.95,56.1 UDRV.TP 17.1,56.1 v15.6,57.6
N$11
  Bottom 0.254: IC2.2 20.12,60.23 R8.2 20.88,59.88 21.6,60.6 21.6,62.6 21.1,63.1 R7.2
N$12
  Bottom 0.254: IC1.8 16.55,18.66 16.1,19.1 16.1,21.1 15.85,21.35 XTAL2.TP
N$13
  Bottom 0.254: IC1.7 15.98,18.32 15.57,18.73 15.57,20.13 15.1,20.6 14.1,20.6 13.6,21.1 XTAL1.TP
N$16
  Bottom 0.254: U$2.3 7.64,9.89 7.72,9.97 C12.1
N$17
  Bottom 0.254: U$2.4 6.55,9.27 6.72,9.1 8.57,9.1 C12.2
N$18
  Bottom 0.254: U$2.1 6.13,11.13 6.6,11.6 6.6,12.1 7.1,12.6 8.45,12.6 C13.1
N$19
  Bottom 0.254: U$2.2 6.28,10.51 C13.2
N$20
  Bottom 0.254: U$2.13 6.84,3.69 7.43,3.1 C15.1
N$21
  Bottom 0.254: 6.05,4.31 U$2.12 7.46,4.31 R10.2
N$22
  Bottom 0.254: C14.1 7.6,1.6 6.1,3.1 5.13,3.1 U$2.14
N$51  (via drill 0.35)
  Top 0.254: 3V3_OK.A 49.48,62.72 v49.6,62.6
  Bottom 0.254: R20.2 46.75,50.75 49.55,53.55 | 49.55,53.55 49.6,53.6 | v49.6,62.6 49.6,53.6 | 49.6,53.6 49.55,53.55
PWR_SW  (via drill 0.35)
  Top 0.254: S1.2 38.95,6.6 v38.6,6.6 | v14.6,7.85 12.6,9.85 12.6,11.6 v13.85,12.85
  Bottom 0.254: v38.6,5.6 v38.6,6.6 38.6,7.1 38.1,7.6 29.6,7.6 29.35,7.35 29.35,4.35 28.6,3.6 18.85,3.6 v14.6,7.85 | IC1.31 13.85,12.68 v13.85,12.85
RESET  (via drill 0.35)
  Top 0.254: v17.6,13.6 25.85,21.85 v28.35,21.85
  Bottom 0.254: R9.2 13.41,9.97 IC1.29 17.03,13.6 v17.6,13.6 | U$4.RST J1.2 28.66,21.85 v28.35,21.85
SCK  (via drill 0.35)
  Top 0.254: v25.1,24.1 25.1,23.1 v21.6,19.6
  Bottom 0.254: IC6.3 13.96,45.23 14.6,44.6 14.6,26.6 v21.6,19.6 24.1,17.1 24.1,14.1 22.62,12.62 IC1.17 | 29.6,25.6 J1.4 29.1,25.6 28.6,26.1 28.6,29.1 28.1,29.6 26.6,29.6 26.1,29.1 26.1,26.6 25.1,25.6 v25.1,24.1
SCL
  Bottom 0.254: U$2.10 6.38,5.55 6.86,6.03 11.29,6.03 12.6,7.35 12.6,7.95 R14.1 12.67,8.1 IC1.28 | 14.63,10.28 IC1.28 | IC4.5 35,56.2 35.6,55.6 35.6,32.35 34.85,31.6 17.6,31.6 16.6,30.6 16.6,28.6 25.6,19.6 25.6,12.6 26.64,11.56 26.64,6.39 25.85,5.6 19.87,5.6 18.1,7.37 18.1,8.1 17.6,8.6 17.6,9.6 16.35,10.85 15.42,10.85 IC1.28
SDA  (via drill 0.35)
  Top 0.254: v14.72,9.03 16.17,9.03 v17.35,7.85
  Bottom 0.254: U$2.11 6.55,4.93 7.14,5.53 11.53,5.53 11.87,5.87 | IC4.4 38.2,57.7 36.1,55.6 36.1,32.1 35.1,31.1 17.85,31.1 17.1,30.35 17.1,29.1 26.1,20.1 26.1,13.1 27.1,12.1 27.1,6.1 26.1,5.1 19.6,5.1 17.35,7.35 17.38,7.85 v17.35,7.85 | IC1.27 v14.72,9.03 13.6,7.9 13.6,7.6 11.87,5.87 | R11.1 12.45,5.29 11.87,5.87
TEMP  (via drill 0.35)
  Top 0.254: U3.2 16.1,39.15 v16.1,38.6
  Bottom 0.254: IC1.23 21.27,7.1 25.6,7.1 26.13,7.63 26.13,11.07 25.1,12.1 24.6,12.1 24.1,12.6 24.1,13.1 24.6,13.6 24.6,18.6 15.6,27.6 15.6,38.1 v16.1,38.6
VLOAD_ATT
  Bottom 0.254: 37.65,63.6 R13.2 | 37.65,63.6 R12.1 | IC4.1 38.7,61.51 37.6,62.6 37.6,63.55 37.65,63.6 | R13.2 38.75,63.75 | R13.2 38.75,64.75 | 38.75,64.75 UATT.TP | 38.75,64.75 38.75,65.65 37.8,66.6 D3.C
VLOAD_DROP  (via drill 0.35)
  Top 0.254: v22.1,57.1 31.1,57.1 31.6,57.6 31.6,60.19 v31.55,60.23
  Bottom 0.254: 32.23,60.23 IC4.7 | 32.23,60.23 v31.55,60.23 29.56,60.23 29.4,60.07 | UDROP.TP 32.1,60.37 32.23,60.23 | v22.1,57.1 21.63,57.57 21.3,57.57 21.29,57.58 19.87,57.58 19.63,57.82 19.63,58.7 19.35,58.98 IC2.3
  Bottom 2.032: R5.2 29.4,60.07 29.4,57.4 Q1.P$3
VLOAD_REF
  Bottom 0.254: IC6.8 16.5,54.7 13.5,57.7 IC2.5 11.1,55.8 USET.TP
VSW
  Bottom 0.508: JP1.PWR 40.6,71.1 44.1,67.6 47.1,67.6 47.6,67.1 47.6,56.1 47.1,55.6 42.6,55.6 42.1,55.1 42.1,54.55 D2.A

### Text on the board
tPlace: 40V / 6A | POWER / ENABLE | - | +
bPlace: PocketLoad / by nupo-artworks.de | github.com/dangrie158/pocket-load | MEGA8
bNames: LM358 | MCP3426 | TL431 | MCP4921
Milling: CUT / OUT